# EAGLE schematic ADC2 (EAGLE 9.6.2)
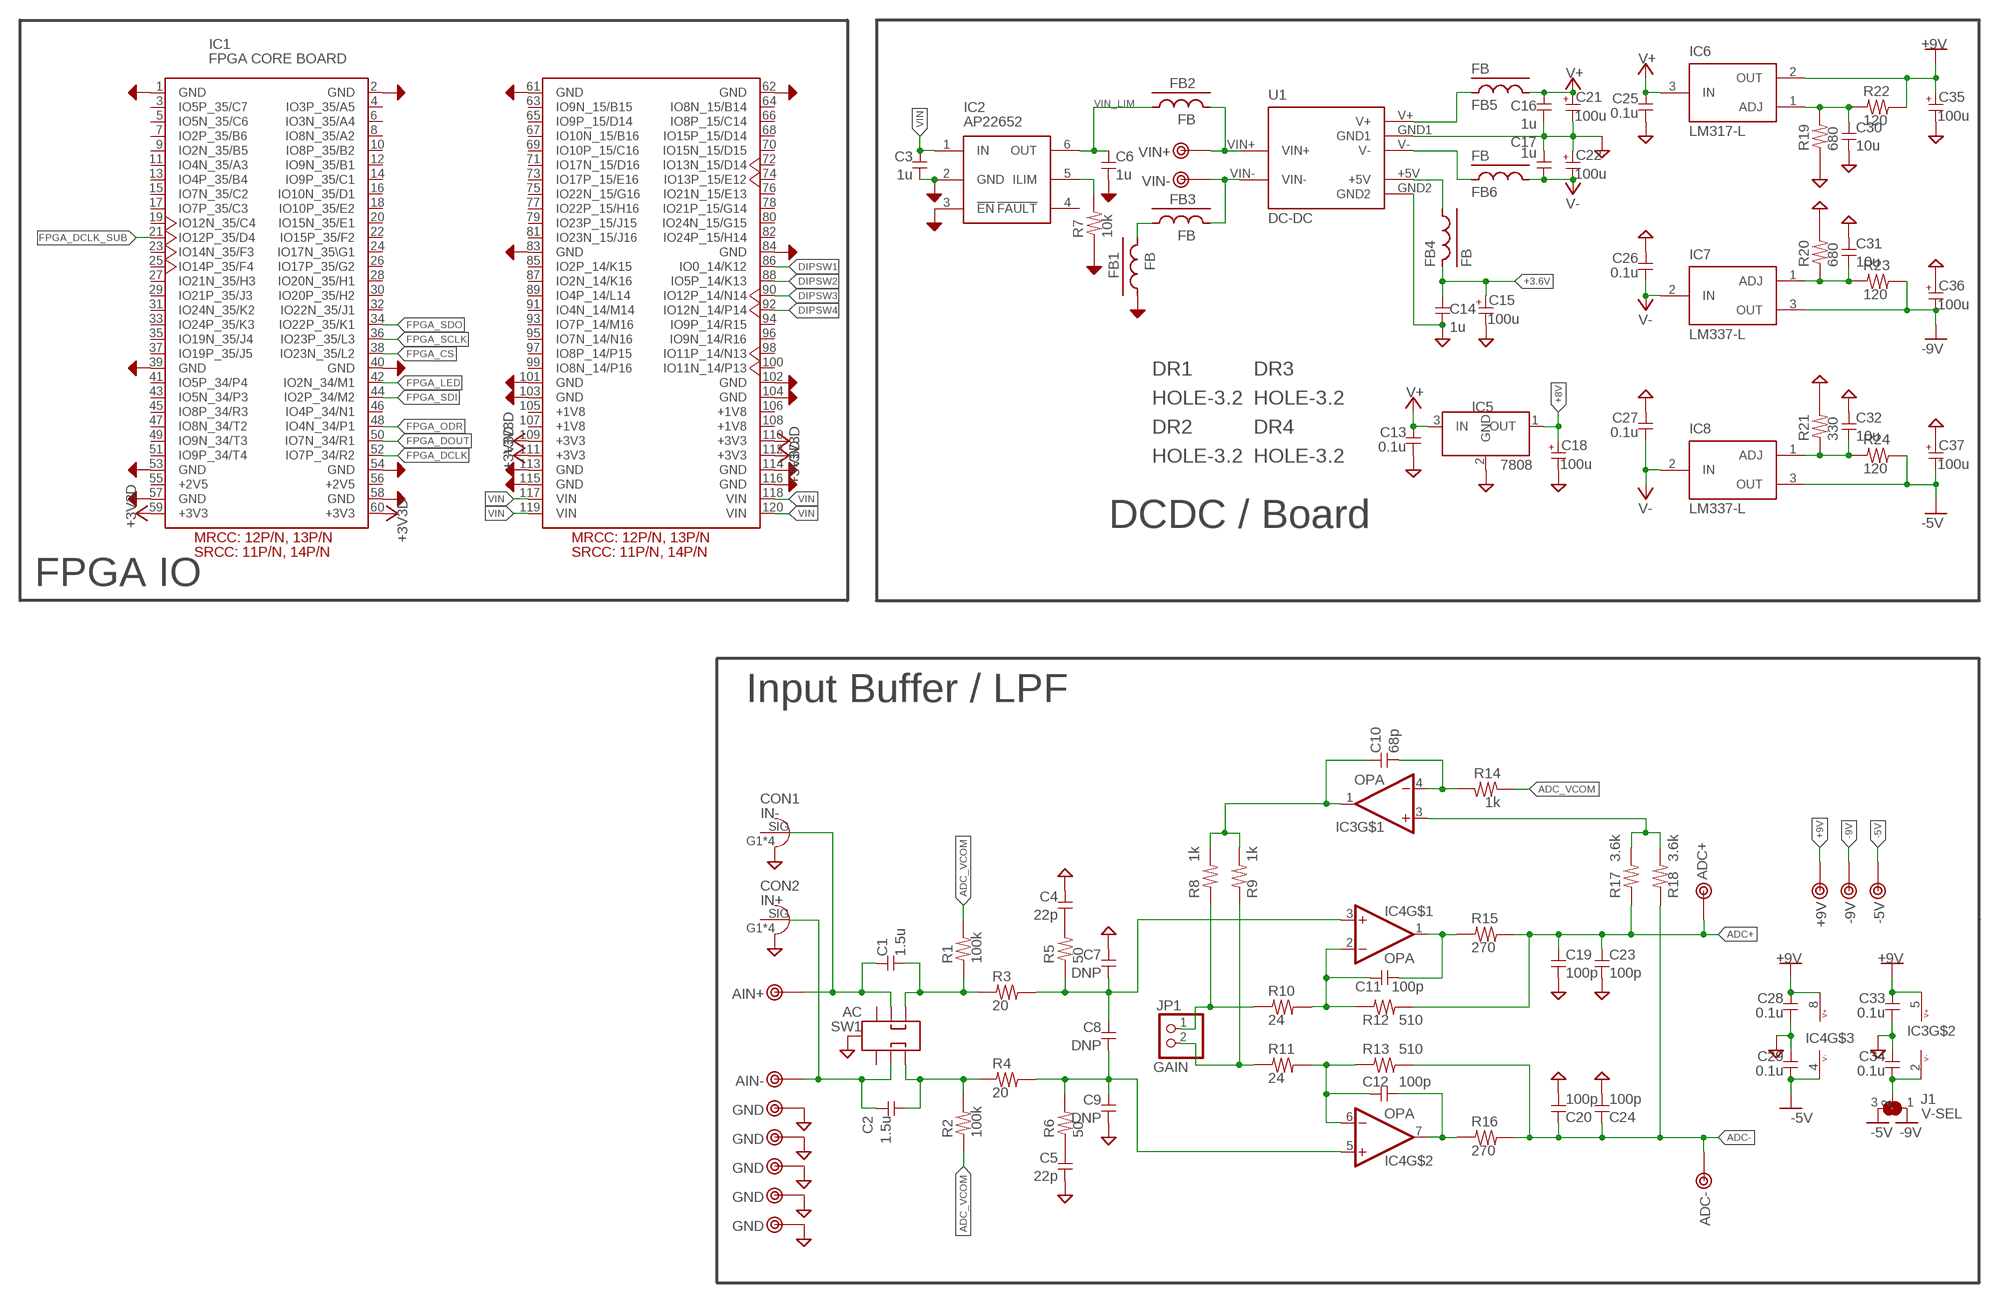
[diagram p0: schematic, sheet 1, part 1 of 2]
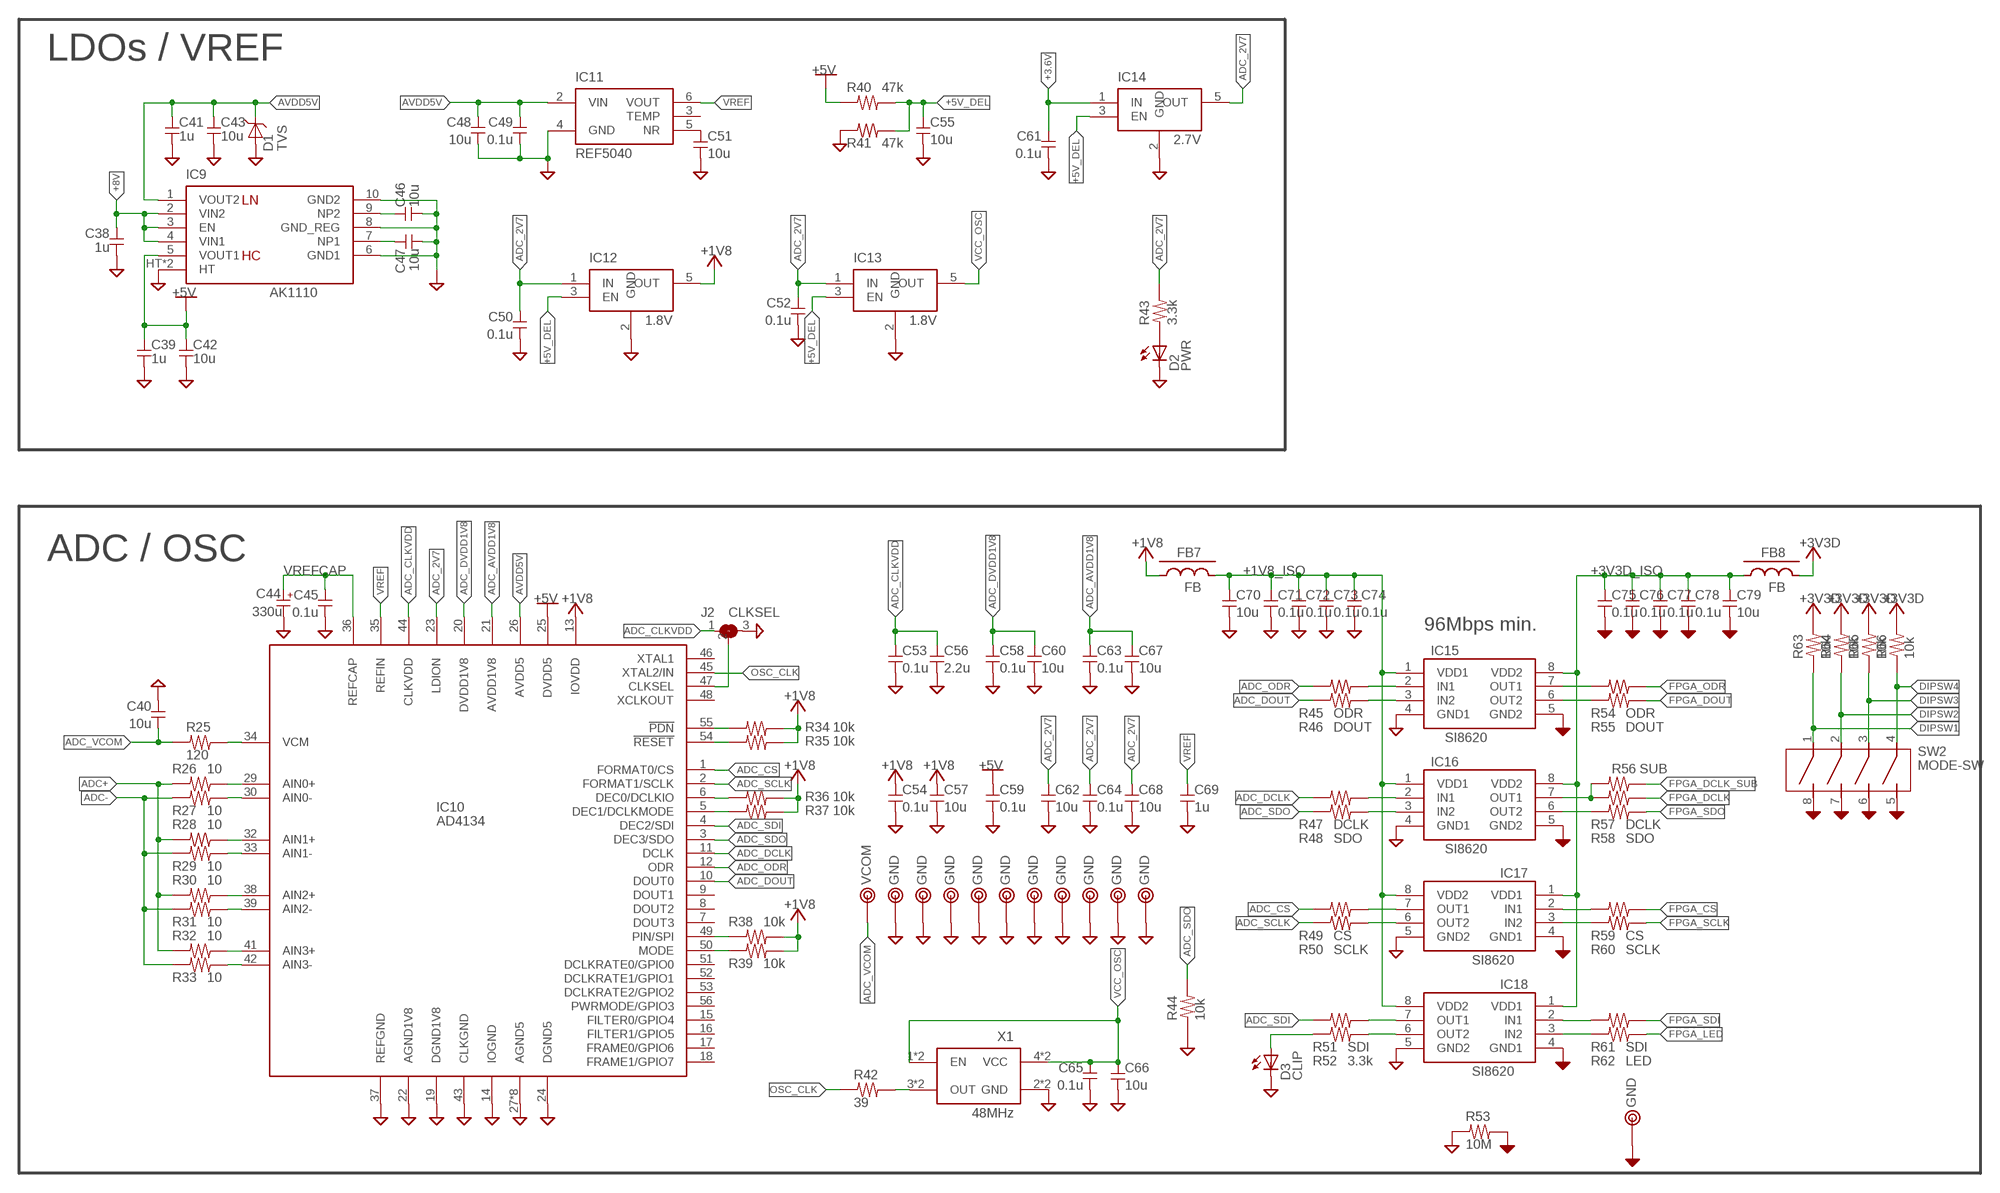
[diagram p1: schematic, sheet 1, part 2 of 2]

## Parts
C1  1.5u  C-5  [C050]
C2  1.5u  C-5  [C050]
C3  1u  C-1608  [1608C]
C4  22p  C-1608  [1608C]
C5  22p  C-1608  [1608C]
C6  1u  C-1608  [1608C]
C7  DNP  C-1608  [1608C]
C8  DNP  C-1608-3  [1608-3]
C9  DNP  C-1608  [1608C]
C10  68p  C-1608-3  [1608-3]
C11  100p  C-1608  [1608C]
C12  100p  C-1608  [1608C]
C13  0.1u  C-1608  [1608C]
C14  1u  C-1608  [1608C]
C15  100u  CPOLE2.5-8  [E2,5-8]
C16  1u  C-1608  [1608C]
C17  1u  C-1608  [1608C]
C18  100u  CPOLE2.5-6.5  [E2.5-6.5]
C19  100p  C-1608-3  [1608-3]
C20  100p  C-1608-3  [1608-3]
C21  100u  CPOLE2.5-8  [E2,5-8]
C22  100u  CPOLE2.5-8  [E2,5-8]
C23  100p  C-1608  [1608C]
C24  100p  C-1608  [1608C]
C25  0.1u  C-1608  [1608C]
C26  0.1u  C-1608  [1608C]
C27  0.1u  C-1608  [1608C]
C28  0.1u  C-1608  [1608C]
C29  0.1u  C-1608  [1608C]
C30  10u  C-3216  [3216]
C31  10u  C-3216  [3216]
C32  10u  C-3216  [3216]
C33  0.1u  C-1608  [1608C]
C34  0.1u  C-1608  [1608C]
C35  100u  CPOLE2.5-6.5  [E2.5-6.5]
C36  100u  CPOLE2.5-6.5  [E2.5-6.5]
C37  100u  CPOLE2.5-6.5  [E2.5-6.5]
C38  1u  C-1608  [1608C]
C39  1u  C-1608  [1608C]
C40  10u  C-2012  [2012]
C41  1u  C-1608  [1608C]
C42  10u  C-2012  [2012]
C43  10u  C-2012  [2012]
C44  330u  CPOLE2.5-6.5  [E2.5-6.5]
C45  0.1u  C-1608  [1608C]
C46  10u  C-2012  [2012]
C47  10u  C-2012  [2012]
C48  10u  C-2012  [2012]
C49  0.1u  C-1608  [1608C]
C50  0.1u  C-1608  [1608C]
C51  10u  C-3216  [3216]
C52  0.1u  C-1608  [1608C]
C53  0.1u  C-1608  [1608C]
C54  0.1u  C-1608  [1608C]
C55  10u  C-2012  [2012]
C56  2.2u  C-2012  [2012]
C57  10u  C-2012  [2012]
C58  0.1u  C-1608  [1608C]
C59  0.1u  C-1608  [1608C]
C60  10u  C-2012  [2012]
C61  0.1u  C-1608  [1608C]
C62  10u  C-2012  [2012]
C63  0.1u  C-1608  [1608C]
C64  0.1u  C-1608  [1608C]
C65  0.1u  C-1608  [1608C]
C66  10u  C-2012  [2012]
C67  10u  C-2012  [2012]
C68  10u  C-2012  [2012]
C69  1u  C-1608  [1608C]
C70  10u  C-1608  [1608C]
C71  0.1u  C-1608  [1608C]
C72  0.1u  C-1608  [1608C]
C73  0.1u  C-1608  [1608C]
C74  0.1u  C-1608  [1608C]
C75  0.1u  C-1608  [1608C]
C76  0.1u  C-1608  [1608C]
C77  0.1u  C-1608  [1608C]
C78  0.1u  C-1608  [1608C]
C79  10u  C-1608  [1608C]
CON1  IN-  SMA-142-0701-801  [SMA-EDGE]
CON2  IN+  SMA-142-0701-801  [SMA-EDGE]
D1  TVS  ZENER-SMD2  [SOD323]
D2  PWR  LED-SMD1608  [D1608]
D3  CLIP  LED-SMD1608  [D1608]
DR1  HOLE-3.2  [HOLE_3.2]
DR2  HOLE-3.2  [HOLE_3.2]
DR3  HOLE-3.2  [HOLE_3.2]
DR4  HOLE-3.2  [HOLE_3.2]
FB1  FB  FB-2012  [2012-J]
FB2  FB  FB-2012  [2012-J]
FB3  FB  FB-2012  [2012-J]
FB4  FB  FB-2012  [2012-J]
FB5  FB  FB-2012  [2012-J]
FB6  FB  FB-2012  [2012-J]
FB7  FB  FB-1608FB  [1608-FB]
FB8  FB  FB-1608FB  [1608-FB]
IC1  FPGA CORE BOARD  FPGA_CORE_BOARD  [FPGA_CORE_BOARD]
IC2  AP22652  [SOT23-6]
IC3  OPA  OPA-1  [SOT23-5]
IC4  OPA  OPA-2-SOP  [SOP8-3]
IC5  7808  78LX  [TO-92]
IC6  LM317-L  [TO-92]
IC7  LM337-L  [TO-92]
IC8  LM337-L  [TO-92]
IC9  AK1110  [PLP10]
IC10  AD4134  [QFN56-HT-HOLE]
IC11  REF5040  [SOP8]
IC12  1.8V  TLV740  [SOT23-5]
IC13  1.8V  TLV740  [SOT23-5]
IC14  2.7V  TLV740  [SOT23-5]
IC15  SI8620  SI8420  [SOP8-2]
IC16  SI8620  SI8420  [SOP8-2]
IC17  SI8620  SI8420  [SOP8-2]
IC18  SI8620  SI8420  [SOP8-2]
J1  V-SEL  SJ-3-1608  [1608-3-J]
J2  CLKSEL  SJ-3-1608  [1608-3-J]
JP1  GAIN  PINHD-1X2  [1X02]
R1  100k  R-1608-3  [1608-3]
R2  100k  R-1608-3  [1608-3]
R3  20  R-2012H  [2012-R]
R4  20  R-2012H  [2012-R]
R5  50  R-1608-3  [1608-3]
R6  50  R-1608-3  [1608-3]
R7  10k  R-1608  [1608]
R8  1k  R-1608-3  [1608-3]
R9  1k  R-1608-3  [1608-3]
R10  24  R-1608-3  [1608-3]
R11  24  R-1608-3  [1608-3]
R12  510  R-2012H  [2012-R]
R13  510  R-2012H  [2012-R]
R14  1k  R-1608  [1608]
R15  270  R-2012H  [2012-R]
R16  270  R-2012H  [2012-R]
R17  3.6k  R-1608  [1608]
R18  3.6k  R-1608  [1608]
R19  680  R-1608  [1608]
R20  680  R-1608  [1608]
R21  330  R-1608  [1608]
R22  120  R-1608  [1608]
R23  120  R-1608  [1608]
R24  120  R-1608  [1608]
R25  120  R-1608  [1608]
R26  10  R-1608-3  [1608-3]
R27  10  R-1608  [1608]
R28  10  R-1608-3  [1608-3]
R29  10  R-1608-3  [1608-3]
R30  10  R-1608-3  [1608-3]
R31  10  R-1608-3  [1608-3]
R32  10  R-1608  [1608]
R33  10  R-1608-3  [1608-3]
R34  10k  R-1608  [1608]
R35  10k  R-1608  [1608]
R36  10k  R-1608  [1608]
R37  10k  R-1608  [1608]
R38  10k  R-1608  [1608]
R39  10k  R-1608  [1608]
R40  47k  R-1608  [1608]
R41  47k  R-1608  [1608]
R42  39  R-1608  [1608]
R43  3.3k  R-1608  [1608]
R44  10k  R-1608  [1608]
R45  ODR  R-1608-3  [1608-3]
R46  DOUT  R-1608-3  [1608-3]
R47  DCLK  R-1608  [1608]
R48  SDO  R-1608  [1608]
R49  CS  R-1608  [1608]
R50  SCLK  R-1608  [1608]
R51  SDI  R-1608  [1608]
R52  3.3k  R-1608  [1608]
R53  10M  R-7.5  [0204/7]
R54  ODR  R-1608  [1608]
R55  DOUT  R-1608  [1608]
R56  SUB  R-1608  [1608]
R57  DCLK  R-1608  [1608]
R58  SDO  R-1608  [1608]
R59  CS  R-1608  [1608]
R60  SCLK  R-1608  [1608]
R61  SDI  R-1608  [1608]
R62  LED  R-1608  [1608]
R63  10k  R-1608  [1608]
R64  10k  R-1608  [1608]
R65  10k  R-1608  [1608]
R66  10k  R-1608  [1608]
SW1  AC  SS22E01G5  [SS22E01G5]
SW2  MODE-SW  DIPSW-4  [DIPSW-4]
TP1  GND  TESTPIN-MID  [TESTPIN-MID]
TP2  AIN+  TESTPIN-MID  [TESTPIN-MID]
TP3  GND  TESTPIN-MID  [TESTPIN-MID]
TP4  GND  TESTPIN  [TESTPIN]
TP5  GND  TESTPIN  [TESTPIN]
TP6  AIN-  TESTPIN-MID  [TESTPIN-MID]
TP7  GND  TESTPIN  [TESTPIN]
TP8  GND  TESTPIN  [TESTPIN]
TP9  GND  TESTPIN  [TESTPIN]
TP10  GND  TESTPIN  [TESTPIN]
TP11  GND  TESTPIN  [TESTPIN]
TP12  GND  TESTPIN  [TESTPIN]
TP13  GND  TESTPIN  [TESTPIN]
TP14  GND  TESTPIN  [TESTPIN]
TP15  GND  TESTPIN  [TESTPIN]
TP16  +9V  TESTPIN  [TESTPIN]
TP17  -9V  TESTPIN  [TESTPIN]
TP18  -5V  TESTPIN  [TESTPIN]
TP19  GND  TESTPIN-MID  [TESTPIN-MID]
TP20  GND  TESTPIN-MID  [TESTPIN-MID]
TP21  GND  TESTPIN-MID  [TESTPIN-MID]
TP22  VCOM  TESTPIN  [TESTPIN]
TP23  ADC+  TESTPIN  [TESTPIN]
TP24  ADC-  TESTPIN  [TESTPIN]
TP30  VIN+  TESTPIN  [TESTPIN]
TP31  VIN-  TESTPIN  [TESTPIN]
U1  DC-DC  [DCDC]
X1  48MHz  OSC-KC7050  [KC7050]

## Nets
+1V8: C54.1 C57.1 FB7.1 IC10.13(IOVDD) IC12.5(OUT) R34.2 R35.2 R36.2 R37.2 R38.2 R39.2
+1V8_ISO: C70.1 C71.1 C72.1 C73.1 C74.1 FB7.2 IC15.1(VDD1) IC16.1(VDD1) IC17.8(VDD2) IC18.8(VDD2)
+3.6V: C14.1 C15.+ C61.1 FB4.1 IC14.1(IN)
+3V3D: FB8.2 IC1.59(+3V3) IC1.60(+3V3) IC1.109(+3V3) IC1.110(+3V3) IC1.111(+3V3) IC1.112(+3V3) R63.2 R64.2 R65.2 R66.2
+3V3D_ISO: C75.1 C76.1 C77.1 C78.1 C79.1 FB8.1 IC15.8(VDD2) IC16.8(VDD2) IC17.1(VDD1) IC18.1(VDD1)
+5V: C39.1 C42.1 C59.1 IC9.5(VOUT1) IC10.25(DVDD5) R40.1
+5V_DEL: C55.1 IC12.3(EN) IC13.3(EN) IC14.3(EN) R40.2 R41.2
+8V: C18.+ C38.1 IC5.1(OUT) IC9.2(VIN2) IC9.3(EN) IC9.4(VIN1)
+9V: C28.1 C33.1 C35.+ IC3.5(V+) IC4.8(V+) IC6.2(OUT) R22.2 TP16.1
-5V: C29.2 C37.- IC4.4(V-) IC8.3(OUT) J1.3 R24.2 TP18.1
-9V: C36.- IC7.3(OUT) J1.1 R23.2 TP17.1
ADC+: C19.1 C23.1 R12.2 R15.2 R17.1 R26.1 R28.1 R30.1 R32.1 TP23.1
ADC-: C20.1 C24.1 R13.2 R16.2 R18.1 R27.1 R29.1 R31.1 R33.1 TP24.1
ADC_2V7: C50.1 C52.1 C62.1 C64.1 C68.1 IC10.23(LDION) IC12.1(IN) IC13.1(IN) IC14.5(OUT) R43.2
ADC_AVDD1V8: C63.1 C67.1 IC10.21(AVDD1V8)
ADC_CLKVDD: C53.1 C56.1 IC10.44(CLKVDD) J2.1
ADC_CS: IC10.1(FORMAT0/CS) R49.1
ADC_DCLK: IC10.11(DCLK) R47.1
ADC_DOUT: IC10.10(DOUT0) R46.1
ADC_DVDD1V8: C58.1 C60.1 IC10.20(DVDD1V8)
ADC_ODR: IC10.12(ODR) R45.1
ADC_SCLK: IC10.2(FORMAT1/SCLK) R50.1
ADC_SDI: IC10.4(DEC2/SDI) R51.1
ADC_SDO: IC10.3(DEC3/SDO) R44.2 R48.1
ADC_VCOM: C40.2 R1.2 R2.1 R14.1 R25.1 TP22.1
AVDD5V: C41.1 C43.1 C48.1 C49.1 D1.2(C) IC9.1(VOUT2) IC10.26(AVDD5) IC11.2(VIN)
DGND: C3.2 C6.2 C75.2 C76.2 C77.2 C78.2 C79.2 FB1.1 IC1.1(GND) IC1.2(GND) IC1.39(GND) IC1.40(GND) IC1.53(GND) IC1.54(GND) IC1.57(GND) IC1.58(GND) IC1.61(GND) IC1.62(GND) IC1.83(GND) IC1.84(GND) IC1.101(GND) IC1.102(GND) IC1.103(GND) IC1.104(GND) IC1.113(GND) IC1.114(GND) IC1.115(GND) IC1.116(GND) IC2.2(GND) IC2.3(!EN) IC15.5(GND2) IC16.5(GND2) IC17.4(GND1) IC18.4(GND1) R7.1 R53.2 SW2.5(B4) SW2.6(B3) SW2.7(B2) SW2.8(B1) TP13.1
DIPSW1: IC1.86(IO0_14/K12) R63.1 SW2.1(A1)
DIPSW2: IC1.88(IO5P_14/K13) R64.1 SW2.2(A2)
DIPSW3: IC1.90(IO12P_14/N14) R65.1 SW2.3(A3)
DIPSW4: IC1.92(IO12N_14/P14) R66.1 SW2.4(A4)
FPGA_CS: IC1.38(IO23N_35/L2) R59.2
FPGA_DCLK: IC1.52(IO7P_34/R2) R57.2
FPGA_DCLK_SUB: IC1.21(IO12P_35/D4) R56.2
FPGA_DOUT: IC1.50(IO7N_34/R1) R55.2
FPGA_LED: IC1.42(IO2N_34/M1) R62.2
FPGA_ODR: IC1.48(IO4N_34/P1) R54.2
FPGA_SCLK: IC1.36(IO23P_35/L3) R60.2
FPGA_SDI: IC1.44(IO2P_34/M2) R61.2
FPGA_SDO: IC1.34(IO22P_35/K1) R58.2
GND: C4.1 C5.2 C7.1 C9.2 C13.2 C14.2 C15.- C16.2 C17.1 C18.- C19.2 C20.2 C21.- C22.+ C23.2 C24.2 C25.2 C26.1 C27.1 C28.2 C29.1 C30.2 C31.1 C32.1 C33.2 C34.1 C35.- C36.+ C37.+ C38.2 C39.2 C40.1 C41.2 C42.2 C43.2 C44.- C45.2 C46.2 C47.2 C48.2 C49.2 C50.2 C51.2 C52.2 C53.2 C54.2 C55.2 C56.2 C57.2 C58.2 C59.2 C60.2 C61.2 C62.2 C63.2 C64.2 C65.2 C66.2 C67.2 C68.2 C69.2 C70.2 C71.2 C72.2 C73.2 C74.2 CON1.G1(GND) CON1.G2(GND) CON1.G3(GND) CON1.G4(GND) CON2.G1(GND) CON2.G2(GND) CON2.G3(GND) CON2.G4(GND) D1.1(A) D2.K D3.K IC5.2(GND) IC9.6(GND1) IC9.8(GND_REG) IC9.10(GND2) IC9.HT IC9.HT2(HT) IC10.14(IOGND) IC10.19(DGND1V8) IC10.22(AGND1V8) IC10.24(DGND5) IC10.27(AGND5) IC10.31(AGND5) IC10.37(REFGND) IC10.40(AGND5) IC10.43(CLKGND) IC10.HT1(AGND5) IC10.HT2(AGND5) IC10.HT3(AGND5) IC10.HT4(AGND5) IC10.HT(AGND5) IC11.4(GND) IC12.2(GND) IC13.2(GND) IC14.2(GND) IC15.4(GND1) IC16.4(GND1) IC17.5(GND2) IC18.5(GND2) J2.3 R19.1 R20.2 R21.2 R41.1 R44.1 R53.1 SW1.HT1(SHIELD) SW1.HT2(SHIELD) TP1.1 TP3.1 TP4.1 TP5.1 TP7.1 TP8.1 TP9.1 TP10.1 TP11.1 TP12.1 TP14.1 TP15.1 TP19.1 TP20.1 TP21.1 U1.GND1 U1.GND2 X1.2(GND) X1.2-2(GND)
N$1: C12.1 IC4.6(-IN) R11.2 R13.1
N$2: IC10.34(VCM) R25.2
N$3: C11.1 IC4.2(-IN) R10.2 R12.1
N$4: C4.2 R5.2
N$5: C10.1 IC3.1(OUT) R8.2 R9.2
N$6: C46.1 IC9.9(NP2)
N$7: C47.1 IC9.7(NP1)
N$8: IC15.2(IN1) R45.2
N$9: IC15.3(IN2) R46.2
N$10: IC16.2(IN1) R47.2
N$11: IC10.42(AIN3-) R33.2
N$12: C5.1 R6.1
N$13: IC10.41(AIN3+) R32.2
N$14: C7.2 C8.1 IC4.3(+IN) R3.2 R5.1
N$15: IC10.39(AIN2-) R31.2
N$16: IC16.3(IN2) R48.2
N$17: IC15.6(OUT2) R55.1
N$18: IC10.38(AIN2+) R30.2
N$19: IC3.3(+IN) R17.2 R18.2
N$20: IC10.33(AIN1-) R29.2
N$21: IC15.7(OUT1) R54.1
N$22: C10.2 IC3.4(-IN) R14.2
N$23: C8.2 C9.1 IC4.5(+IN) R4.2 R6.2
N$24: C34.2 IC3.2(V-) J1.2
N$25: IC10.32(AIN1+) R28.2
N$27: IC16.7(OUT1) R56.1 R57.1
N$28: IC10.30(AIN0-) R27.2
N$29: IC10.29(AIN0+) R26.2
N$30: R42.2 X1.3(OUT) X1.3-2(OUT)
N$31: C11.2 IC4.1(OUT) R15.1
N$32: IC16.6(OUT2) R58.1
N$33: IC17.6(OUT2) R50.2
N$34: IC17.7(OUT1) R49.2
N$35: IC18.6(OUT2) R52.2
N$36: IC18.7(OUT1) R51.2
N$37: IC17.3(IN2) R60.1
N$38: IC17.2(IN1) R59.1
N$39: IC18.3(IN2) R62.1
N$40: IC18.2(IN1) R61.1
N$41: C1.1 CON1.SIG SW1.C2 TP2.1
N$42: C2.1 CON2.SIG SW1.C1 TP6.1
N$43: C1.2 R1.1 R3.1 SW1.A2
N$44: C2.2 R2.2 R4.1 SW1.A1
N$45: JP1.1 R8.1 R10.1
N$46: JP1.2 R9.1 R11.1
N$47: D3.A R52.1
N$48: C51.1 IC11.5(NR)
N$49: IC10.5(DEC1/DCLKMODE) R37.1
N$50: IC10.6(DEC0/DCLKIO) R36.1
N$51: FB4.2 U1.+5V
N$52: C12.2 IC4.7(OUT) R16.1
N$53: C30.1 IC6.1(ADJ) R19.2 R22.1
N$54: C31.2 IC7.1(ADJ) R20.1 R23.1
N$55: C32.2 IC8.1(ADJ) R21.1 R24.1
N$56: FB1.2 FB3.1
N$57: IC10.47(CLKSEL) J2.2
N$58: D2.A R43.1
N$60: IC10.50(MODE) R39.1
N$61: IC10.55(!PDN) R34.1
N$62: IC10.54(!RESET) R35.1
N$63: IC2.5(ILIM) R7.2
N$64: IC10.49(PIN/SPI) R38.1
N$70: FB5.1 U1.V+
N$71: FB6.1 U1.V-
N$75: FB2.2 TP30.1 U1.VIN+
N$76: FB3.2 TP31.1 U1.VIN-
OSC_CLK: IC10.45(XTAL2/IN) R42.1
V+: C13.1 C16.1 C21.+ C25.1 FB5.2 IC5.3(IN) IC6.3(IN)
V-: C17.2 C22.- C26.2 C27.2 FB6.2 IC7.2(IN) IC8.2(IN)
VCC_OSC: C65.1 C66.1 IC13.5(OUT) X1.1(EN) X1.1-2(EN) X1.4(VCC) X1.4-2(VCC)
VIN: C3.1 IC1.117(VIN) IC1.118(VIN) IC1.119(VIN) IC1.120(VIN) IC2.1(IN)
VIN_LIM: C6.1 FB2.1 IC2.6(OUT)
VREF: C69.1 IC10.35(REFIN) IC11.6(VOUT)
VREFCAP: C44.+ C45.1 IC10.36(REFCAP)
Unconnected: IC1.3(IO5P_35/C7) IC1.4(IO3P_35/A5) IC1.5(IO5N_35/C6) IC1.6(IO3N_35/A4) IC1.7(IO2P_35/B6) IC1.8(IO8N_35/A2) IC1.9(IO2N_35/B5) IC1.10(IO8P_35/B2) IC1.11(IO4N_35/A3) IC1.12(IO9N_35/B1) IC1.13(IO4P_35/B4) IC1.14(IO9P_35/C1) IC1.15(IO7N_35/C2) IC1.16(IO10N_35/D1) IC1.17(IO7P_35/C3) IC1.18(IO10P_35/E2) IC1.19(IO12N_35/C4) IC1.20(IO15N_35/E1) IC1.22(IO15P_35/F2) IC1.23(IO14N_35/F3) IC1.24(IO17N_35\G1) IC1.25(IO14P_35/F4) IC1.26(IO17P_35/G2) IC1.27(IO21N_35/H3) IC1.28(IO20N_35/H1) IC1.29(IO21P_35/J3) IC1.30(IO20P_35/H2) IC1.31(IO24N_35/K2) IC1.32(IO22N_35/J1) IC1.33(IO24P_35/K3) IC1.35(IO19N_35/J4) IC1.37(IO19P_35/J5) IC1.41(IO5P_34/P4) IC1.43(IO5N_34/P3) IC1.45(IO8P_34/R3) IC1.46(IO4P_34/N1) IC1.47(IO8N_34/T2) IC1.49(IO9N_34/T3) IC1.51(IO9P_34/T4) IC1.55(+2V5) IC1.56(+2V5) IC1.63(IO9N_15/B15) IC1.64(IO8N_15/B14) IC1.65(IO9P_15/D14) IC1.66(IO8P_15/C14) IC1.67(IO10N_15/B16) IC1.68(IO15P_15/D14) IC1.69(IO10P_15/C16) IC1.70(IO15N_15/D15) IC1.71(IO17N_15/D16) IC1.72(IO13N_15/D14) IC1.73(IO17P_15/E16) IC1.74(IO13P_15/E12) IC1.75(IO22N_15/G16) IC1.76(IO21N_15/E13) IC1.77(IO22P_15/H16) IC1.78(IO21P_15/G14) IC1.79(IO23P_15/J15) IC1.80(IO24N_15/G15) IC1.81(IO23N_15/J16) IC1.82(IO24P_15/H14) IC1.85(IO2P_14/K15) IC1.87(IO2N_14/K16) IC1.89(IO4P_14/L14) IC1.91(IO4N_14/M14) IC1.93(IO7P_14/M16) IC1.94(IO9P_14/R15) IC1.95(IO7N_14/N16) IC1.96(IO9N_14/R16) IC1.97(IO8P_14/P15) IC1.98(IO11P_14/N13) IC1.99(IO8N_14/P16) IC1.100(IO11N_14/P13) IC1.105(+1V8) IC1.106(+1V8) IC1.107(+1V8) IC1.108(+1V8) IC2.4(!FAULT) IC10.7(DOUT3) IC10.8(DOUT2) IC10.9(DOUT1) IC10.15(FILTER0/GPIO4) IC10.16(FILTER1/GPIO5) IC10.17(FRAME0/GPIO6) IC10.18(FRAME1/GPIO7) IC10.46(XTAL1) IC10.48(XCLKOUT) IC10.51(DCLKRATE0/GPIO0) IC10.52(DCLKRATE1/GPIO1) IC10.53(DCLKRATE2/GPIO2) IC10.56(PWRMODE/GPIO3) IC11.3(TEMP) SW1.B1 SW1.B2

## Notes on the sheet
- LDOs / VREF
- DCDC / Board
- FPGA IO | ADC / OSC
- 96Mbps min.
- Input Buffer / LPF

## Library data of the parts
C1-C14 C16 C17 C19 C20 C23-C34 C38-C43 C45-C79 = my_rcl:C
C15 C18 C21 C22 C35-C37 C44 = my_rcl:CPOL
CON1 CON2 = my_connector:SMA
D1 = my_rcl:ZENER
D2 D3 = my_rcl:LED
DR1-DR4 = my_connector:HOLE-3.2
FB1-FB8 = my_rcl:FB
IC1 = my_ic:FPGA_CORE_BOARD
IC2 = my_ic:AP22652
IC3 = my_ic:OPA-1
IC4 = my_ic:OPA-2
IC5 = my_ic:78LX
IC6 = my_ic:LM317
IC7 IC8 = my_ic:LM337
IC9 = my_ic:AK1110
IC10 = my_ic:AD4134
IC11 = my_ic:REF5040
IC12-IC14 = my_ic:TLV740
IC15-IC18 = my_ic:SI8420
J1 J2 = my_rcl:SJ-3
JP1 = my_connector:PINHD-1X2
R1-R66 = my_rcl:R
SW1 = my_connector:SS22E01G5
SW2 = my_rcl:DIPSW-4
TP1-TP24 TP30 TP31 = my_connector:TESTPIN
U1 = my_ic:DC-DC
X1 = my_rcl:OSC